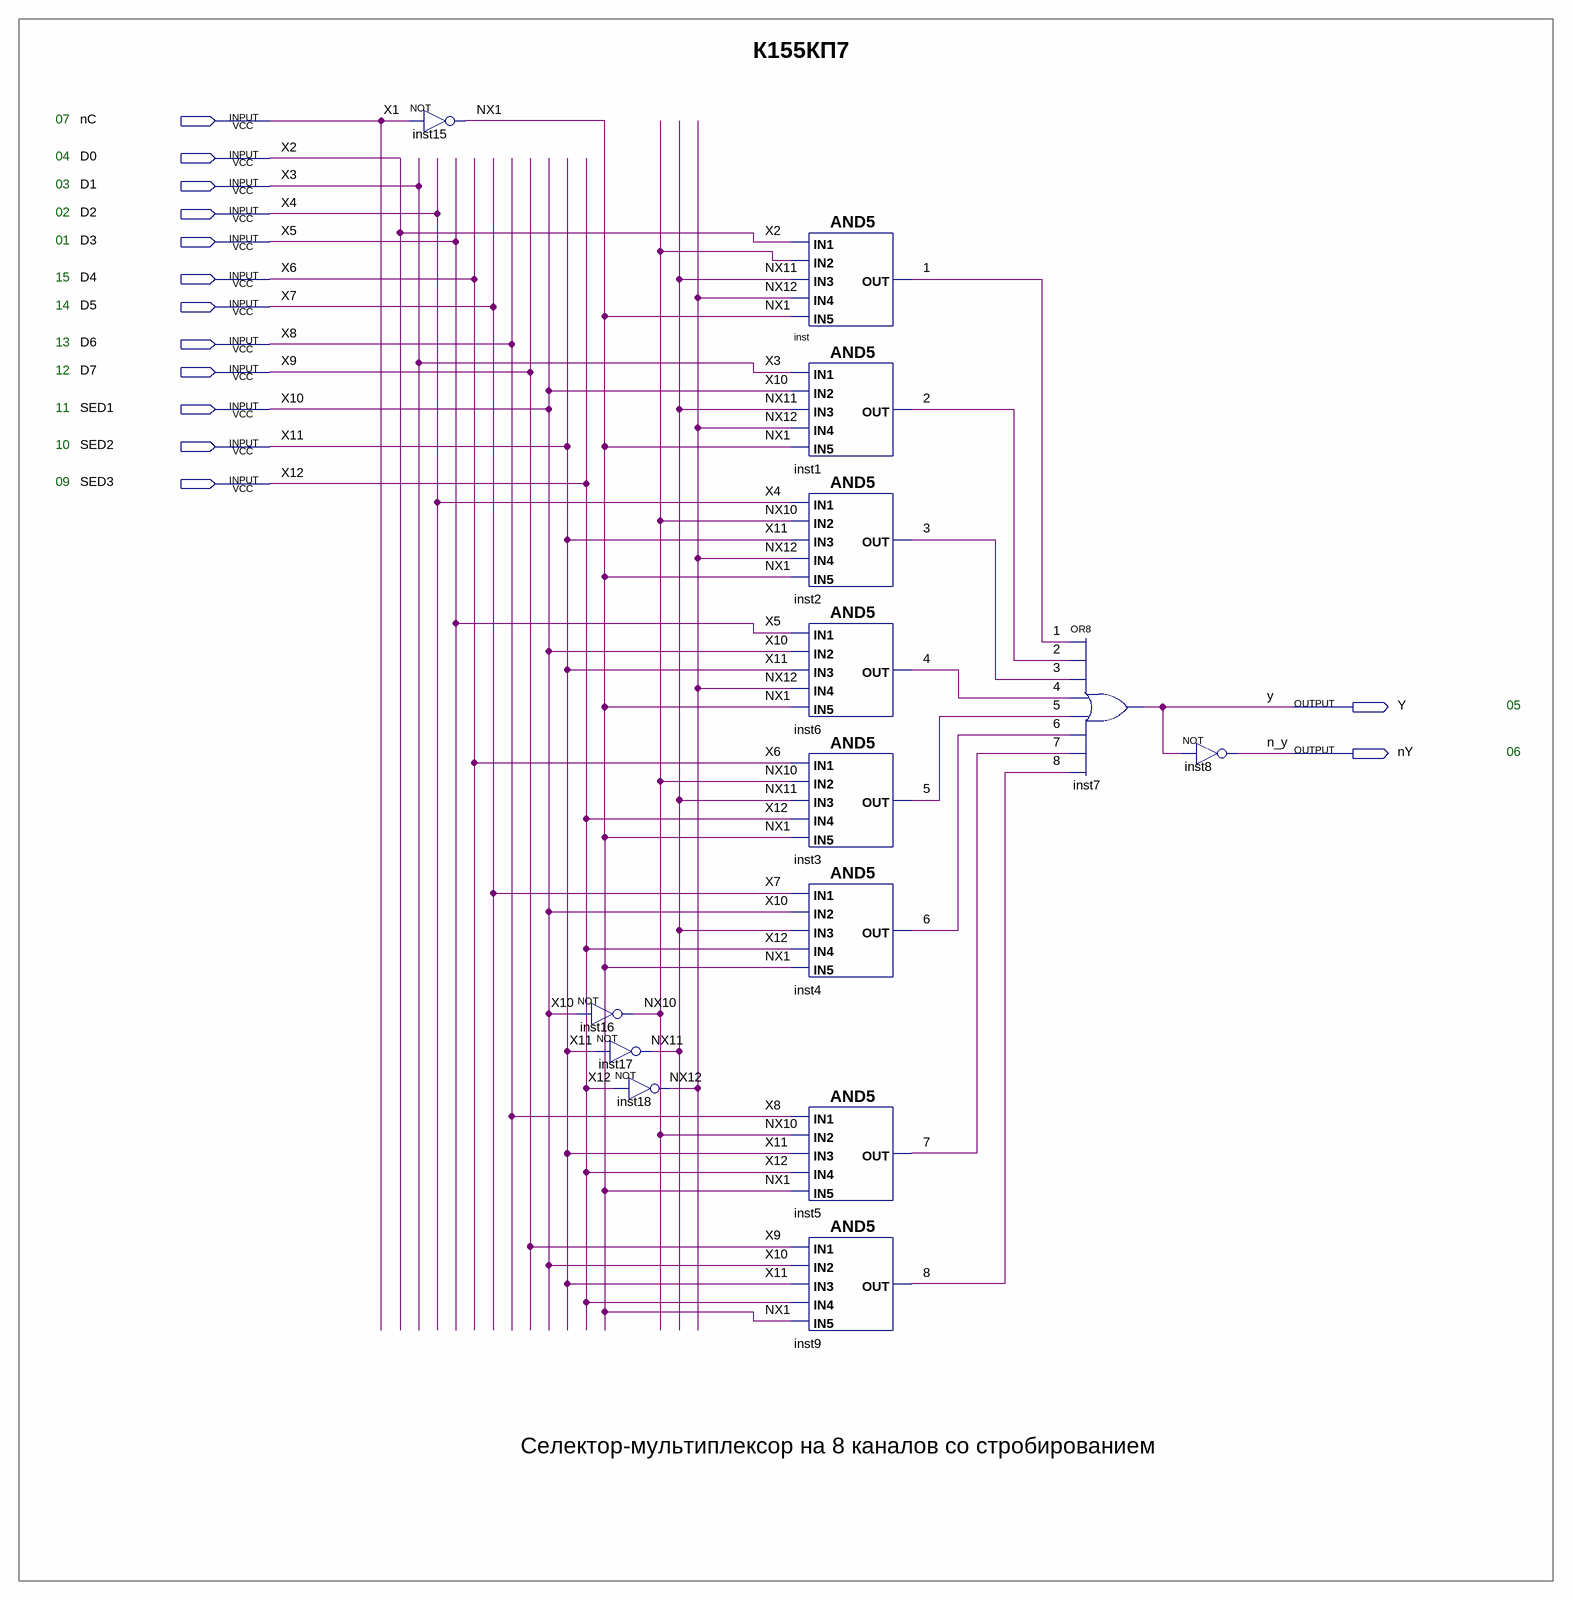
[diagram p0: schematic sheet]
// Quartus schematic K155KP7.bdf as structural Verilog: 14 symbols, 14 pins
module K155KP7 (
  input  nC,
  input  D0,
  input  D1,
  input  D2,
  input  D3,
  input  D4,
  input  D5,
  input  D6,
  input  D7,
  input  SED1,
  input  SED2,
  input  SED3,
  output Y,
  output nY
);

  wire \1 , \2 , \3 , \4 , \5 , \6 , \7 , \8 , NX1, NX10, NX11, NX12;

  not inst15 (NX1, nC);
  not inst16 (NX10, SED1);
  not inst17 (NX11, SED2);
  not inst18 (NX12, SED3);
  and inst (\1 , D0, NX10, NX11, NX12, NX1);
  and inst1 (\2 , D1, SED1, NX11, NX12, NX1);
  and inst2 (\3 , D2, NX10, SED2, NX12, NX1);
  and inst6 (\4 , D3, SED1, SED2, NX12, NX1);
  and inst3 (\5 , D4, NX10, NX11, SED3, NX1);
  and inst4 (\6 , D5, SED1, NX11, SED3, NX1);
  and inst5 (\7 , D6, NX10, SED2, SED3, NX1);
  and inst9 (\8 , D7, SED1, SED2, SED3, NX1);
  or inst7 (Y, \1 , \2 , \3 , \4 , \5 , \6 , \7 , \8 );
  not inst8 (nY, Y);

  // Other names for the same wires on the sheet: n_y = nY; X1 = nC; X2 = D0; X3 = D1; X4 = D2; X5 = D3; X6 = D4;
  //   X7 = D5; X8 = D6; X9 = D7; X10 = SED1; X11 = SED2; X12 = SED3

  // Notes on the sheet:
  //   К155КП7
  //   07
  //   04
  //   03
  //   02
  //   01
  //   15
  //   14
  //   13
  //   12
  //   11
  //   10
  //   09
  //   05
  //   06
  //   Селектор-мультиплексор на 8 каналов со стробированием
endmodule
